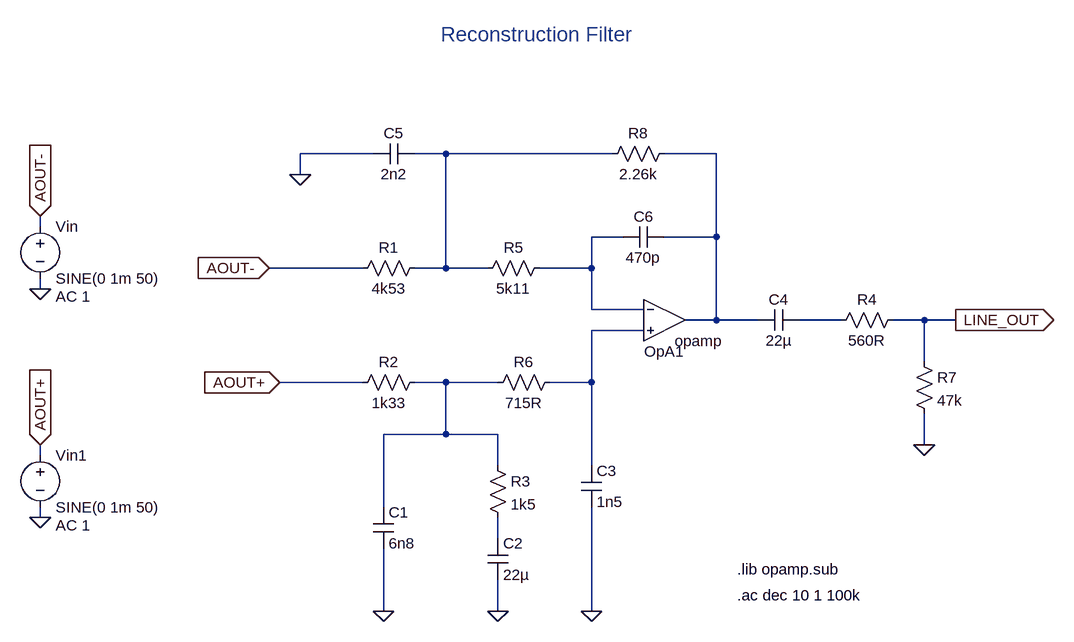
[diagram p0: schematic reconstruction_filter.asc]
reconstruction_filter.asc, the LTspice schematic file:
Version 4
SHEET 1 1092 800
WIRE 16 -64 -96 -64
WIRE 128 -64 80 -64
WIRE 384 -64 128 -64
WIRE 544 -64 464 -64
WIRE -96 -32 -96 -64
WIRE -496 48 -496 32
WIRE 400 64 352 64
WIRE 544 64 544 -64
WIRE 544 64 464 64
WIRE 0 112 -144 112
WIRE 128 112 128 -64
WIRE 128 112 80 112
WIRE 192 112 128 112
WIRE 352 112 352 64
WIRE 352 112 272 112
WIRE -496 144 -496 128
WIRE 352 176 352 112
WIRE 432 176 352 176
WIRE 544 192 544 64
WIRE 544 192 496 192
WIRE 608 192 544 192
WIRE 736 192 672 192
WIRE 864 192 816 192
WIRE 912 192 864 192
WIRE 432 208 352 208
WIRE 864 256 864 192
WIRE 0 288 -128 288
WIRE 128 288 80 288
WIRE 208 288 128 288
WIRE 352 288 352 208
WIRE 352 288 288 288
WIRE 128 368 128 288
WIRE 128 368 32 368
WIRE 208 368 128 368
WIRE 864 384 864 336
WIRE -496 400 -496 384
WIRE 208 416 208 368
WIRE 352 416 352 288
WIRE 32 480 32 368
WIRE -496 496 -496 480
WIRE 208 528 208 496
WIRE 32 640 32 544
WIRE 208 640 208 592
WIRE 352 640 352 480
FLAG -496 144 0
FLAG -496 32 AOUT-
IOPIN -496 32 In
FLAG -144 112 AOUT-
IOPIN -144 112 In
FLAG 912 192 LINE_OUT
IOPIN 912 192 Out
FLAG -128 288 AOUT+
IOPIN -128 288 In
FLAG -496 496 0
FLAG -496 384 AOUT+
IOPIN -496 384 In
FLAG 208 640 0
FLAG 32 640 0
FLAG 352 640 0
FLAG 864 384 0
FLAG -96 -32 0
SYMBOL voltage -496 32 R0
WINDOW 123 24 124 Left 2
WINDOW 39 0 0 Left 0
SYMATTR Value2 AC 1
SYMATTR InstName Vin
SYMATTR Value SINE(0 1m 50)
SYMBOL OpAmps\\opamp 464 128 R0
WINDOW 0 -31 112 Left 2
SYMATTR InstName OpA1
SYMBOL voltage -496 384 R0
WINDOW 123 24 124 Left 2
WINDOW 39 0 0 Left 0
SYMATTR Value2 AC 1
SYMATTR InstName Vin1
SYMATTR Value SINE(0 1m 50)
SYMBOL res 96 96 R90
WINDOW 0 0 56 VBottom 2
WINDOW 3 32 56 VTop 2
SYMATTR InstName R1
SYMATTR Value 4k53
SYMBOL res 96 272 R90
WINDOW 0 0 56 VBottom 2
WINDOW 3 32 56 VTop 2
SYMATTR InstName R2
SYMATTR Value 1k33
SYMBOL res 288 96 R90
WINDOW 0 0 56 VBottom 2
WINDOW 3 32 56 VTop 2
SYMATTR InstName R5
SYMATTR Value 5k11
SYMBOL res 304 272 R90
WINDOW 0 0 56 VBottom 2
WINDOW 3 32 56 VTop 2
SYMATTR InstName R6
SYMATTR Value 715R
SYMBOL cap 16 480 R0
SYMATTR InstName C1
SYMATTR Value 6n8
SYMBOL cap 192 528 R0
SYMATTR InstName C2
SYMATTR Value 22µ
SYMBOL res 192 400 R0
SYMATTR InstName R3
SYMATTR Value 1k5
SYMBOL cap 336 416 R0
SYMATTR InstName C3
SYMATTR Value 1n5
SYMBOL res 832 176 R90
WINDOW 0 0 56 VBottom 2
WINDOW 3 32 56 VTop 2
SYMATTR InstName R4
SYMATTR Value 560R
SYMBOL cap 672 176 R90
WINDOW 0 0 32 VBottom 2
WINDOW 3 32 32 VTop 2
SYMATTR InstName C4
SYMATTR Value 22µ
SYMBOL res 848 240 R0
SYMATTR InstName R7
SYMATTR Value 47k
SYMBOL cap 80 -80 R90
WINDOW 0 0 32 VBottom 2
WINDOW 3 32 32 VTop 2
SYMATTR InstName C5
SYMATTR Value 2n2
SYMBOL cap 464 48 R90
WINDOW 0 0 32 VBottom 2
WINDOW 3 32 32 VTop 2
SYMATTR InstName C6
SYMATTR Value 470p
SYMBOL res 480 -80 R90
WINDOW 0 0 56 VBottom 2
WINDOW 3 32 56 VTop 2
SYMATTR InstName R8
SYMATTR Value 2.26k
TEXT 576 576 Left 2 !.lib opamp.sub
TEXT 576 616 Left 2 !.ac dec 10 1 100k
TEXT 120 -248 Left 3 ;Reconstruction Filter

The netlist it stands for:
* reconstruction_filter.asc
Vin AOUT- 0 SINE(0 1m 50) AC 1
XOpA1 N003 N005 N002 opamp Aol=100K GBW=10Meg  ; pins invin noninvin out
Vin1 AOUT+ 0 SINE(0 1m 50) AC 1
R1 N001 AOUT- 4k53
R2 N006 AOUT+ 1k33
R5 N003 N001 5k11
R6 N005 N006 715R
C1 N006 0 6n8
C2 N007 0 22µ
R3 N006 N007 1k5
C3 N005 0 1n5
R4 LINE_OUT N004 560R
C4 N004 N002 22µ
R7 LINE_OUT 0 47k
C5 N001 0 2n2
C6 N002 N003 470p
R8 N002 N001 2.26k
.lib opamp.sub
.ac dec 10 1 100k
* Reconstruction Filter
.backanno
.end